# Altium project Nixie_Clock.PrjPCB
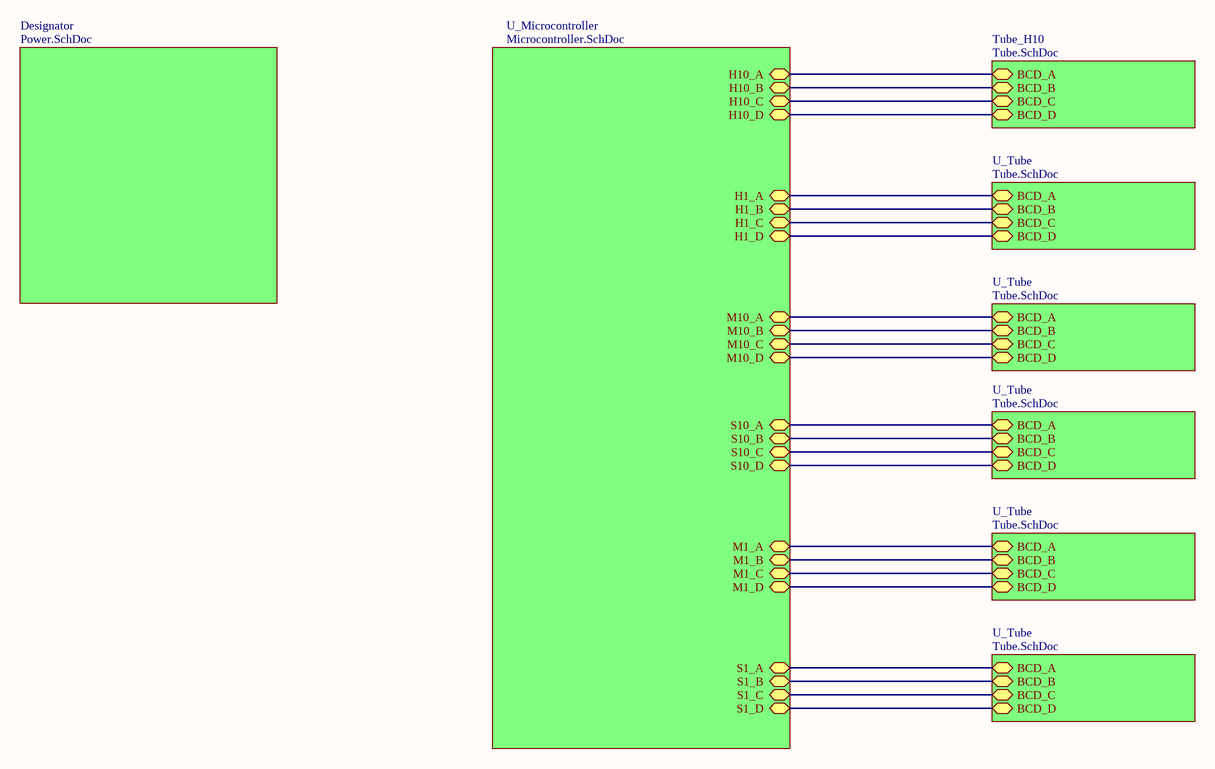
[diagram p0: Main.SchDoc]
Project: Nixie Clock; Revision: 1; Title: =DocumentName
4 sheets, 45 parts. Net scope: hierarchical (ports join the sheet entries above them; power ports are global).
Sheets:
  Main.SchDoc
    Designator = Power.SchDoc
    U_Microcontroller = Microcontroller.SchDoc
    Tube_H10 = Tube.SchDoc
    U_Tube = Tube.SchDoc
    U_Tube = Tube.SchDoc
    U_Tube = Tube.SchDoc
    U_Tube = Tube.SchDoc
    U_Tube = Tube.SchDoc

## Sheet Main.SchDoc: =DocumentName
size B; Organization: Altium Limited; Address1: L3, 12a Rodborough Rd; Address2: Frenchs Forest; Address3: NSW; Address4: Australia 2086

### Sub-sheets
Designator = Power.SchDoc: no entries
Tube_H10 = Tube.SchDoc: BCD_A, BCD_B, BCD_C, BCD_D
U_Microcontroller = Microcontroller.SchDoc: H10_A, H10_B, H10_C, H10_D, H1_A, H1_B, H1_C, H1_D, M10_A, M10_B, M10_C, M10_D, S10_A, S10_B, S10_C, S10_D, M1_A, M1_B, M1_C, M1_D, S1_A, S1_B, S1_C, S1_D
U_Tube = Tube.SchDoc: BCD_A, BCD_B, BCD_C, BCD_D
U_Tube = Tube.SchDoc: BCD_A, BCD_B, BCD_C, BCD_D
U_Tube = Tube.SchDoc: BCD_A, BCD_B, BCD_C, BCD_D
U_Tube = Tube.SchDoc: BCD_A, BCD_B, BCD_C, BCD_D
U_Tube = Tube.SchDoc: BCD_A, BCD_B, BCD_C, BCD_D

### Nets
BCD_A: sheet U_Microcontroller/H10_A, sheet Tube_H10/BCD_A
BCD_A: sheet U_Microcontroller/H1_A, sheet U_Tube/BCD_A  [a separate net that carries the same name]
BCD_A: sheet U_Microcontroller/M10_A, sheet U_Tube/BCD_A  [a separate net that carries the same name]
BCD_A: sheet U_Microcontroller/M1_A, sheet U_Tube/BCD_A  [a separate net that carries the same name]
BCD_A: sheet U_Microcontroller/S10_A, sheet U_Tube/BCD_A  [a separate net that carries the same name]
BCD_A: sheet U_Microcontroller/S1_A, sheet U_Tube/BCD_A  [a separate net that carries the same name]
BCD_B: sheet U_Microcontroller/H10_B, sheet Tube_H10/BCD_B
BCD_B: sheet U_Microcontroller/H1_B, sheet U_Tube/BCD_B  [a separate net that carries the same name]
BCD_B: sheet U_Microcontroller/M10_B, sheet U_Tube/BCD_B  [a separate net that carries the same name]
BCD_B: sheet U_Microcontroller/M1_B, sheet U_Tube/BCD_B  [a separate net that carries the same name]
BCD_B: sheet U_Microcontroller/S10_B, sheet U_Tube/BCD_B  [a separate net that carries the same name]
BCD_B: sheet U_Microcontroller/S1_B, sheet U_Tube/BCD_B  [a separate net that carries the same name]
BCD_C: sheet U_Microcontroller/H10_C, sheet Tube_H10/BCD_C
BCD_C: sheet U_Microcontroller/H1_C, sheet U_Tube/BCD_C  [a separate net that carries the same name]
BCD_C: sheet U_Microcontroller/M10_C, sheet U_Tube/BCD_C  [a separate net that carries the same name]
BCD_C: sheet U_Microcontroller/M1_C, sheet U_Tube/BCD_C  [a separate net that carries the same name]
BCD_C: sheet U_Microcontroller/S10_C, sheet U_Tube/BCD_C  [a separate net that carries the same name]
BCD_C: sheet U_Microcontroller/S1_C, sheet U_Tube/BCD_C  [a separate net that carries the same name]
BCD_D: sheet U_Microcontroller/H10_D, sheet Tube_H10/BCD_D
BCD_D: sheet U_Microcontroller/H1_D, sheet U_Tube/BCD_D  [a separate net that carries the same name]
BCD_D: sheet U_Microcontroller/M10_D, sheet U_Tube/BCD_D  [a separate net that carries the same name]
BCD_D: sheet U_Microcontroller/M1_D, sheet U_Tube/BCD_D  [a separate net that carries the same name]
BCD_D: sheet U_Microcontroller/S10_D, sheet U_Tube/BCD_D  [a separate net that carries the same name]
BCD_D: sheet U_Microcontroller/S1_D, sheet U_Tube/BCD_D  [a separate net that carries the same name]

### Notes on the sheet
- Title
- Size:
- Date:
- B
- Number:
- Time:
- Revision:
- Sheet
- of
- File:

## Sheet Power.SchDoc: =DocumentName
size B; Organization: Altium Limited; Address1: L3, 12a Rodborough Rd; Address2: Frenchs Forest; Address3: NSW; Address4: Australia 2086
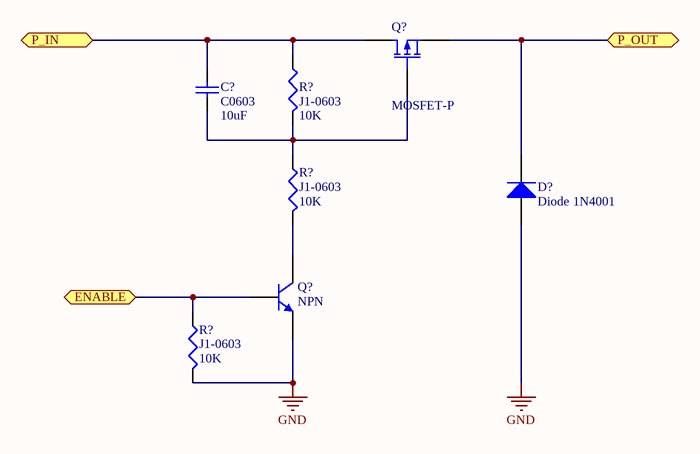
[diagram p1: Power.SchDoc]

### Parts
(Parts that share a designator on the sheet are numbered #1, #2 ... from top to bottom, then left to right.)
C?#1  C0603  value 10uF  [1608[0603]]
D?#1  Diode 1N4001  [DO-41]
Q?#1  MOSFET-P  [E3]
Q?#2  NPN  [TO-226-AA]
R?#1  J1-0603  value 10K  [RESC1608X06N]
R?#2  J1-0603  value 10K  [RESC1608X06N]
R?#3  J1-0603  value 10K  [RESC1608X06N]

### Ports
ENABLE, P_IN, P_OUT

### Nets
GND: D?#1.1(A) Q?#2.3(E) R?#3.2
NetC?#1_1: C?#1.1 Q?#1.2(G) R?#1.2 R?#2.1
NetC?#1_2: C?#1.2 Q?#1.1(D) R?#1.1 ; port P_IN
NetD?#1_2: D?#1.2(K) Q?#1.3(S) ; port P_OUT
NetQ?#2_1: Q?#2.1(C) R?#2.2
NetQ?#2_2: Q?#2.2(B) R?#3.1 ; port ENABLE

### Notes on the sheet
- Title
- Size:
- Date:
- B
- Number:
- Time:
- Revision:
- Sheet
- of
- File:

### Library data of the parts
C?#1 = Cap Semi: Capacitor (Semiconductor SIM Model); Published: 8-Jun-2000; LatestRevisionDate: 29-May-2009; LatestRevisionNote: IPC-7351 Footprint Added.; PackageReference: C0603; Publisher: Altium Limited; PackageDescription: Chip Capacitor
D?#1 = Diode 1N4001: 1 Amp General Purpose Rectifier; Published: 8-Jun-2000; LatestRevisionDate: 17-Jul-2002; LatestRevisionNote: Re-released for DXP Platform.; DatasheetVersion: 1998; PackageVersion: Aug-1999; PackageReference: DO-41; Publisher: Altium Limited; PackageDescription: Diode, Axial; Body 5.2 x 2.7 mm (LxDia. max), Lead Dia. 0.86 mm (max); Code_JEDEC: DO-204-AL; ComponentLink1Description: Manufacturer Link; ComponentLink1URL: http://www.fairchildsemi.com/; ComponentLink2Description: Datasheet; ComponentLink2URL: http://www.fairchildsemi.com/ds/1N%2F1N4001.pdf
Q?#1 = MOSFET-P: P-Channel MOSFET; Published: 8-Jun-2000; LatestRevisionDate: 17-Jul-2002; LatestRevisionNote: Re-released for DXP Platform.; PackageVersion: 1995/1996; PackageReference: E3; Publisher: Altium Limited; PackageDescription: TO, Flat Index; 3 In-Line, Axial Leads; Body Dia. 4.6mm; Lead Dia. 0.5 mm (max)
Q?#2 = NPN: NPN Bipolar Transistor; Published: 8-Jun-2000; LatestRevisionDate: 17-Jul-2002; LatestRevisionNote: Re-released for DXP Platform.; PackageReference: TO-226-AA; Publisher: Altium Limited; PackageDescription: TO, Flat Index; 3 In-Line, Axial Leads; Body Dia. 4.8mm; Leads 0.55 x 0.51 mm (max); Code_JEDEC: TO-226-AA
R?#1-R?#3 = Res3: Resistor; Published: 8-Jun-2000; LatestRevisionDate: 29-May-2009; LatestRevisionNote: IPC-7351 Footprint Added.; PackageReference: J1-0603; Publisher: Altium Limited; PackageDescription: Chip Resistor

## Sheet Microcontroller.SchDoc: =DocumentName
size B; Organization: Altium Limited; Address1: L3, 12a Rodborough Rd; Address2: Frenchs Forest; Address3: NSW; Address4: Australia 2086
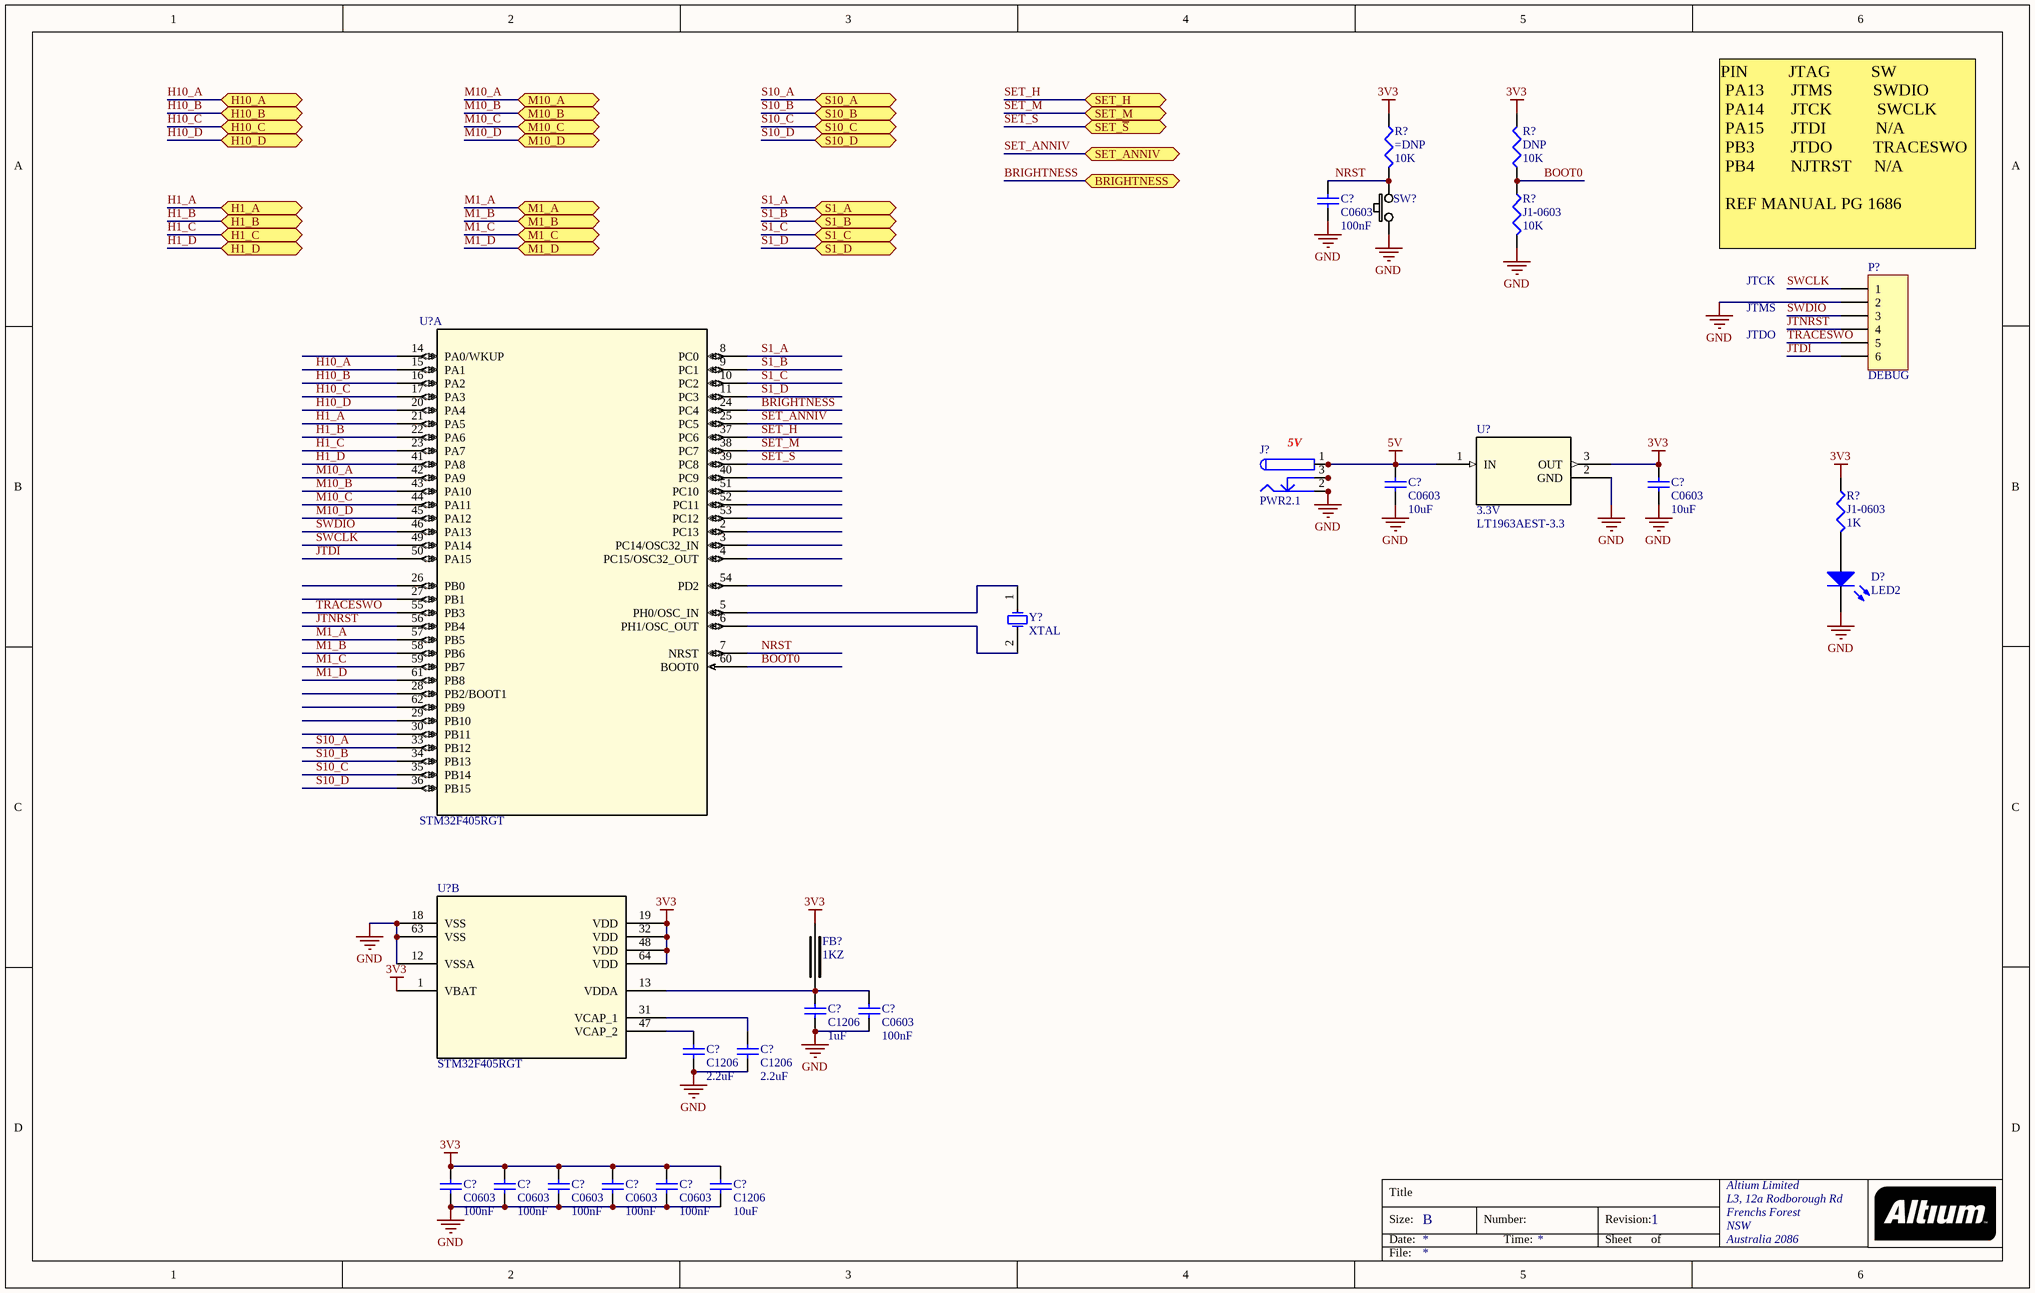
[diagram p2: Microcontroller.SchDoc]

### Parts
(Parts that share a designator on the sheet are numbered #1, #2 ... from top to bottom, then left to right.)
C?#2  C0603  value 100nF  [1608[0603]]
C?#3  C0603  value 10uF  [1608[0603]]
C?#4  C0603  value 10uF  [1608[0603]]
C?#5  C1206  value 1uF  [C1206]
C?#6  C0603  value 100nF  [1608[0603]]
C?#7  C1206  value 2.2uF  [C1206]
C?#8  C1206  value 2.2uF  [C1206]
C?#9  C0603  value 100nF  [1608[0603]]
C?#10  C0603  value 100nF  [1608[0603]]
C?#11  C0603  value 100nF  [1608[0603]]
C?#12  C0603  value 100nF  [1608[0603]]
C?#13  C0603  value 100nF  [1608[0603]]
C?#14  C1206  value 10uF  [C1206]
D?#2  LED2  [1608[0603] - LED]
FB?  1KZ  [0603FB-1KZ]
J?  PWR2.1  [KLD-0202]
P?  DEBUG  [HDR1X6]
R?#4  value 10K  [RESC1608X06N]
R?#5  DNP  value 10K  [RESC1608X06N]
R?#6  J1-0603  value 10K  [RESC1608X06N]
R?#7  J1-0603  value 1K  [RESC1608X06N]
SW?  SW-PB-BLACK-SMD  [SW-PB-SMD]  (value not drawn)
U?#1  STM32F405RGT  [LQFP64-10x10mm]  (part A of 2)
U?#2  3.3V  [SOT-223_ST]
U?#3  STM32F405RGT  [LQFP64-10x10mm]  (part B of 2)
Y?  XTAL  [R38]

### Ports
BRIGHTNESS, H1_A, H1_B, H1_C, H1_D, H10_A, H10_B, H10_C, H10_D, M1_A, M1_B, M1_C, M1_D, M10_A, M10_B, M10_C, M10_D, S1_A, S1_B, S1_C, S1_D, S10_A, S10_B, S10_C, S10_D, SET_ANNIV, SET_H, SET_M, SET_~{S}

### Nets
3V3: C?#4.2 C?#9.2 C?#10.2 C?#11.2 C?#12.2 C?#13.2 C?#14.2 FB?.1 R?#4.1 R?#5.2 R?#7.1 U?#2.3(OUT) U?#3.1(VBAT) U?#3.19(VDD) U?#3.32(VDD) U?#3.48(VDD) U?#3.64(VDD)
5V: C?#3.2 J?.1 J?.1A J?.1B U?#2.1(IN)
GND: C?#2.1 C?#3.1 C?#4.1 C?#5.1 C?#6.1 C?#7.1 C?#8.1 C?#9.1 C?#10.1 C?#11.1 C?#12.1 C?#13.1 C?#14.1 D?#2.2(K) J?.2 J?.2A J?.2B P?.2 R?#6.2 SW?.1 U?#2.2(GND) U?#3.12(VSSA) U?#3.18(VSS) U?#3.63(VSS)
BOOT0: R?#5.1 R?#6.1 U?#1.60(BOOT0)
BRIGHTNESS: U?#1.24(PC4) ; port BRIGHTNESS
H1_A: U?#1.21(PA5) ; port H1_A  [project net BCD_A]
H1_B: U?#1.22(PA6) ; port H1_B  [project net BCD_B]
H1_C: U?#1.23(PA7) ; port H1_C  [project net BCD_C]
H1_D: U?#1.41(PA8) ; port H1_D  [project net BCD_D]
H10_A: U?#1.15(PA1) ; port H10_A  [project net BCD_A]
H10_B: U?#1.16(PA2) ; port H10_B  [project net BCD_B]
H10_C: U?#1.17(PA3) ; port H10_C  [project net BCD_C]
H10_D: U?#1.20(PA4) ; port H10_D  [project net BCD_D]
JTDI: P?.6 U?#1.50(PA15)
JTNRST: P?.4 U?#1.56(PB4)
M1_A: U?#1.57(PB5) ; port M1_A  [project net BCD_A]
M1_B: U?#1.58(PB6) ; port M1_B  [project net BCD_B]
M1_C: U?#1.59(PB7) ; port M1_C  [project net BCD_C]
M1_D: U?#1.61(PB8) ; port M1_D  [project net BCD_D]
M10_A: U?#1.42(PA9) ; port M10_A  [project net BCD_A]
M10_B: U?#1.43(PA10) ; port M10_B  [project net BCD_B]
M10_C: U?#1.44(PA11) ; port M10_C  [project net BCD_C]
M10_D: U?#1.45(PA12) ; port M10_D  [project net BCD_D]
NRST: C?#2.2 R?#4.2 SW?.2 U?#1.7(NRST)
S1_A: U?#1.8(PC0) ; port S1_A  [project net BCD_A]
S1_B: U?#1.9(PC1) ; port S1_B  [project net BCD_B]
S1_C: U?#1.10(PC2) ; port S1_C  [project net BCD_C]
S1_D: U?#1.11(PC3) ; port S1_D  [project net BCD_D]
S10_A: U?#1.33(PB12) ; port S10_A  [project net BCD_A]
S10_B: U?#1.34(PB13) ; port S10_B  [project net BCD_B]
S10_C: U?#1.35(PB14) ; port S10_C  [project net BCD_C]
S10_D: U?#1.36(PB15) ; port S10_D  [project net BCD_D]
SET_ANNIV: U?#1.25(PC5) ; port SET_ANNIV
SET_H: U?#1.37(PC6) ; port SET_H
SET_M: U?#1.38(PC7) ; port SET_M
SET_S: U?#1.39(PC8) ; port SET_~{S}
SWCLK: P?.1 U?#1.49(PA14)
SWDIO: P?.3 U?#1.46(PA13)
TRACESWO: P?.5 U?#1.55(PB3)
NetC?#5_2: C?#5.2 C?#6.2 FB?.2 U?#3.13(VDDA)
NetC?#7_2: C?#7.2 U?#3.47(VCAP_2)
NetC?#8_2: C?#8.2 U?#3.31(VCAP_1)
NetD?#2_1: D?#2.1(A) R?#7.2
NetJ?_3: J?.3 J?.3A J?.3B
NetU?#1_5: U?#1.5(PH0/OSC_IN) Y?.1(OSC1)
NetU?#1_6: U?#1.6(PH1/OSC_OUT) Y?.2(OSC2)

Not connected (* = marked no-connect by the designer): U?#1 2(PC13) 3(PC14/OSC32_IN) 4(PC15/OSC32_OUT) 14(PA0/WKUP) 26(PB0) 27(PB1) 28(PB2/BOOT1) 29(PB10) 30(PB11) 40(PC9) 51(PC10) 52(PC11) 53(PC12) 54(PD2) 62(PB9)

### Notes on the sheet
- (near P?) PIN         JTAG         SW
  PA13      JTMS         SWDIO
  PA14      JTCK          SWCLK
  PA15      JTDI           N/A
  PB3        JTDO         TRACESWO
  PB4        NJTRST     N/A
  REF MANUAL PG 1686
- JTCK
- JTMS
- JTDO
- (near J?) 5V
- Title
- Size:
- Date:
- B
- Number:
- Time:
- Revision:
- Sheet
- of
- File:

### Library data of the parts
C?#2-C?#14 = Cap Semi: Capacitor (Semiconductor SIM Model); Published: 8-Jun-2000; LatestRevisionDate: 29-May-2009; LatestRevisionNote: IPC-7351 Footprint Added.; Publisher: Altium Limited; PackageDescription: Chip Capacitor
  C?#2-C?#4 C?#6 C?#9-C?#13: PackageReference: C0603
  C?#5 C?#7 C?#8 C?#14: PackageReference: C1206
D?#2 = LED2: Typical RED, GREEN, YELLOW, AMBER GaAs LED; PartNumber: APT1608EC; 19-213-R6C-AP1Q2B/3T: PartNumber; Published: 8-Jun-2000; LatestRevisionDate: 17-Jul-2002; LatestRevisionNote: Re-released for DXP Platform.; PackageVersion: Feb-2002; PackageReference: 3.2X1.6X1.1; Publisher: Altium Limited; PackageDescription: SM LED; 2 Flat Leads
FB? = 0603FB-1KZ: FERRITE BEAD 1000 OHM 400mA; Manufacturer: TDK Corporation; Manufacturer Part Number: MMZ1608R102A; Reel: F1; Description: FERRITE CHIP 1000 OHM 400MA 0603; Supplier 1: Digi-Key; Supplier Part Number 1: 445-1548-2-ND
J? = PWR2.5: Low Voltage Power Supply Connector; Published: 17-Dec-2003; DatasheetDocument: 09-May-2002; Publisher: Altium Limited; ComponentLink1Description: Manufacturer Link; ComponentLink1URL: http://domino.kycon.com/internet/Products.html
P? = Header 6: Header, 6-Pin; LatestRevisionDate: 17-Jul-2002; LatestRevisionNote: Re-released for DXP Platform.; Publisher: Altium Limited
R?#4-R?#7 = Res3: Resistor; Published: 8-Jun-2000; LatestRevisionDate: 29-May-2009; LatestRevisionNote: IPC-7351 Footprint Added.; PackageReference: J1-0603; Publisher: Altium Limited; PackageDescription: Chip Resistor
SW? = SW-PB-BLACK-SMD: PUSHBUTTON SWITCH 6MM SMD
U?#1 U?#3 = STM32F4x5RG: No Description Available; Vendor: STMicroelectronics; PartNumber: STM32F405RGT; Copyright: Copyright (C) 2016 Accelerated Designs. All rights reserved; RefDes: RefDes; Type: DEV; Value: Value
U?#2 = LT1963AEST-3.3: No Description Available; Vendor: Linear Technology; Manufacturer_Part_Number: LT1963AEST-3.3; Copyright: Copyright (C) 2018 Accelerated Designs. All rights reserved; RefDes: RefDes; Type: DEV; Value: 3.3V; PartNumber: LT1963AEST-3.3
Y? = XTAL: Crystal Oscillator; Published: 8-Jun-2000; LatestRevisionDate: 17-Jul-2002; LatestRevisionNote: Re-released for DXP Platform.; PackageReference: R38; Publisher: Altium Limited; PackageDescription: Crystal, Thru-Hole; 2 Leads; Body 3.1 x 8.2 mm (Dia.xH)

## Sheet Tube.SchDoc: =DocumentName
size B; Organization: Altium Limited; Address1: L3, 12a Rodborough Rd; Address2: Frenchs Forest; Address3: NSW; Address4: Australia 2086
Used 6 times, as channels Tube_H10, U_Tube, U_Tube, U_Tube, U_Tube, U_Tube. Parts and nets are listed once, with the designators drawn on the sheet.
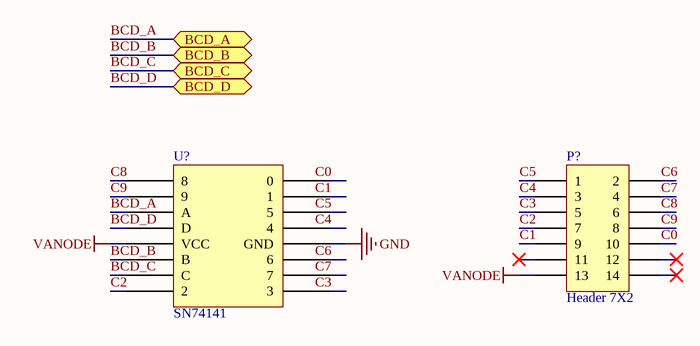
[diagram p3: Tube.SchDoc]

### Parts
P?  Header 7X2  [HDR2X7]
U?  SN74141  [DIP-16]

### Ports
BCD_A, BCD_B, BCD_C, BCD_D

### Nets
GND: U?.12(GND)
VANODE: P?.13 U?.5(VCC)
BCD_A: U?.3(A) ; port BCD_A
BCD_B: U?.6(B) ; port BCD_B
BCD_C: U?.7(C) ; port BCD_C
BCD_D: U?.4(D) ; port BCD_D
C0: P?.10
C1: P?.9
C2: P?.7 U?.8(2)
C3: P?.5
C4: P?.3
C5: P?.1
C6: P?.2
C7: P?.4
C8: P?.6 U?.1(8)
C9: P?.8 U?.2(9)

Not connected (* = marked no-connect by the designer): P? 11* 12* 14*; U? 9(3) 10(7) 11(6) 13(4) 14(5) 15(1) 16(0)

### Channels
Tube_H10: designators end in _Tube_H10; ports BCD_A=BCD_A BCD_B=BCD_B BCD_C=BCD_C BCD_D=BCD_D
U_Tube: designators end in _U_Tube#1; ports BCD_A=BCD_A BCD_B=BCD_B BCD_C=BCD_C BCD_D=BCD_D
U_Tube: designators end in _U_Tube#2; ports BCD_A=BCD_A BCD_B=BCD_B BCD_C=BCD_C BCD_D=BCD_D
U_Tube: designators end in _U_Tube#3; ports BCD_A=BCD_A BCD_B=BCD_B BCD_C=BCD_C BCD_D=BCD_D
U_Tube: designators end in _U_Tube#4; ports BCD_A=BCD_A BCD_B=BCD_B BCD_C=BCD_C BCD_D=BCD_D
U_Tube: designators end in _U_Tube#5; ports BCD_A=BCD_A BCD_B=BCD_B BCD_C=BCD_C BCD_D=BCD_D

### Notes on the sheet
- Labels drawn without touching a wire or pin: C0, C1, C3, C4, C5, C6, C7
- Title
- Size:
- Date:
- B
- Number:
- Time:
- Revision:
- Sheet
- of
- File:

### Library data of the parts
P? = Header 7X2: Header, 7-Pin, Dual row; LatestRevisionDate: 17-Jul-2002; LatestRevisionNote: Re-released for DXP Platform.; Publisher: Altium Limited
U? = BCD-to-Decimal Driver: PartNumber: SN74141

## Nets that join several sheets
GND: Power (D?#1.1 Q?#2.3 R?#3.2), Microcontroller (24 pins), Tube_H10 (U?_Tube_H10.12), U_Tube (U?_U_Tube#1.12), U_Tube (U?_U_Tube#2.12), U_Tube (U?_U_Tube#3.12), U_Tube (U?_U_Tube#4.12), U_Tube (U?_U_Tube#5.12)
VANODE: Tube_H10 (P?_Tube_H10.13 U?_Tube_H10.5), U_Tube (P?_U_Tube#1.13 U?_U_Tube#1.5), U_Tube (P?_U_Tube#2.13 U?_U_Tube#2.5), U_Tube (P?_U_Tube#3.13 U?_U_Tube#3.5), U_Tube (P?_U_Tube#4.13 U?_U_Tube#4.5), U_Tube (P?_U_Tube#5.13 U?_U_Tube#5.5)
BCD_A: Microcontroller (U?#1.15), Tube_H10 (U?_Tube_H10.3)
BCD_A: Microcontroller (U?#1.21), U_Tube (U?_U_Tube#1.3)
BCD_A: Microcontroller (U?#1.42), U_Tube (U?_U_Tube#2.3)
BCD_A: Microcontroller (U?#1.57), U_Tube (U?_U_Tube#4.3)
BCD_A: Microcontroller (U?#1.33), U_Tube (U?_U_Tube#3.3)
BCD_A: Microcontroller (U?#1.8), U_Tube (U?_U_Tube#5.3)
BCD_B: Microcontroller (U?#1.16), Tube_H10 (U?_Tube_H10.6)
BCD_B: Microcontroller (U?#1.22), U_Tube (U?_U_Tube#1.6)
BCD_B: Microcontroller (U?#1.43), U_Tube (U?_U_Tube#2.6)
BCD_B: Microcontroller (U?#1.58), U_Tube (U?_U_Tube#4.6)
BCD_B: Microcontroller (U?#1.34), U_Tube (U?_U_Tube#3.6)
BCD_B: Microcontroller (U?#1.9), U_Tube (U?_U_Tube#5.6)
BCD_C: Microcontroller (U?#1.17), Tube_H10 (U?_Tube_H10.7)
BCD_C: Microcontroller (U?#1.23), U_Tube (U?_U_Tube#1.7)
BCD_C: Microcontroller (U?#1.44), U_Tube (U?_U_Tube#2.7)
BCD_C: Microcontroller (U?#1.59), U_Tube (U?_U_Tube#4.7)
BCD_C: Microcontroller (U?#1.35), U_Tube (U?_U_Tube#3.7)
BCD_C: Microcontroller (U?#1.10), U_Tube (U?_U_Tube#5.7)
BCD_D: Microcontroller (U?#1.20), Tube_H10 (U?_Tube_H10.4)
BCD_D: Microcontroller (U?#1.41), U_Tube (U?_U_Tube#1.4)
BCD_D: Microcontroller (U?#1.45), U_Tube (U?_U_Tube#2.4)
BCD_D: Microcontroller (U?#1.61), U_Tube (U?_U_Tube#4.4)
BCD_D: Microcontroller (U?#1.36), U_Tube (U?_U_Tube#3.4)
BCD_D: Microcontroller (U?#1.11), U_Tube (U?_U_Tube#5.4)